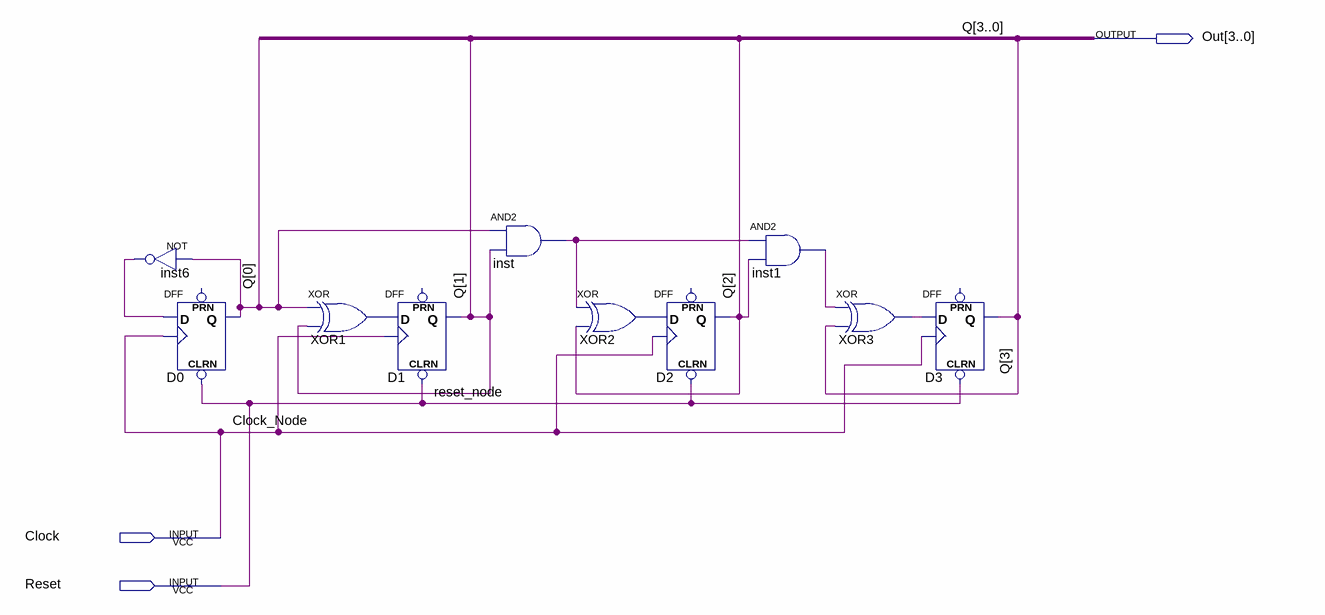
[diagram p0: schematic sheet]
// Quartus schematic UpCounter.bdf as structural Verilog: 10 symbols, 3 pins
module UpCounter (
  input  Clock,
  input  Reset,
  output [3:0] Out
);

  wire inst1_out, inst6_out, inst_out, XOR1_out, XOR2_out, XOR3_out;

  not inst6 (inst6_out, Out[0]);
  DFF D0 (.CLRN(Reset), .CLK(Clock), .D(inst6_out), .Q(Out[0]));  // open: PRN
  xor XOR1 (XOR1_out, Out[0], Out[1]);
  DFF D1 (.CLRN(Reset), .CLK(Clock), .D(XOR1_out), .Q(Out[1]));  // open: PRN
  and inst (inst_out, Out[0], Out[1]);
  xor XOR2 (XOR2_out, inst_out, Out[2]);
  DFF D2 (.CLRN(Reset), .CLK(Clock), .D(XOR2_out), .Q(Out[2]));  // open: PRN
  and inst1 (inst1_out, inst_out, Out[2]);
  xor XOR3 (XOR3_out, inst1_out, Out[3]);
  DFF D3 (.CLRN(Reset), .CLK(Clock), .D(XOR3_out), .Q(Out[3]));  // open: PRN

  // Other names for the same wires on the sheet: Clock_Node = Clock; Q[3:0] = Out; reset_node = Reset
endmodule
